# EAGLE design trophy (EAGLE 9.2.2)
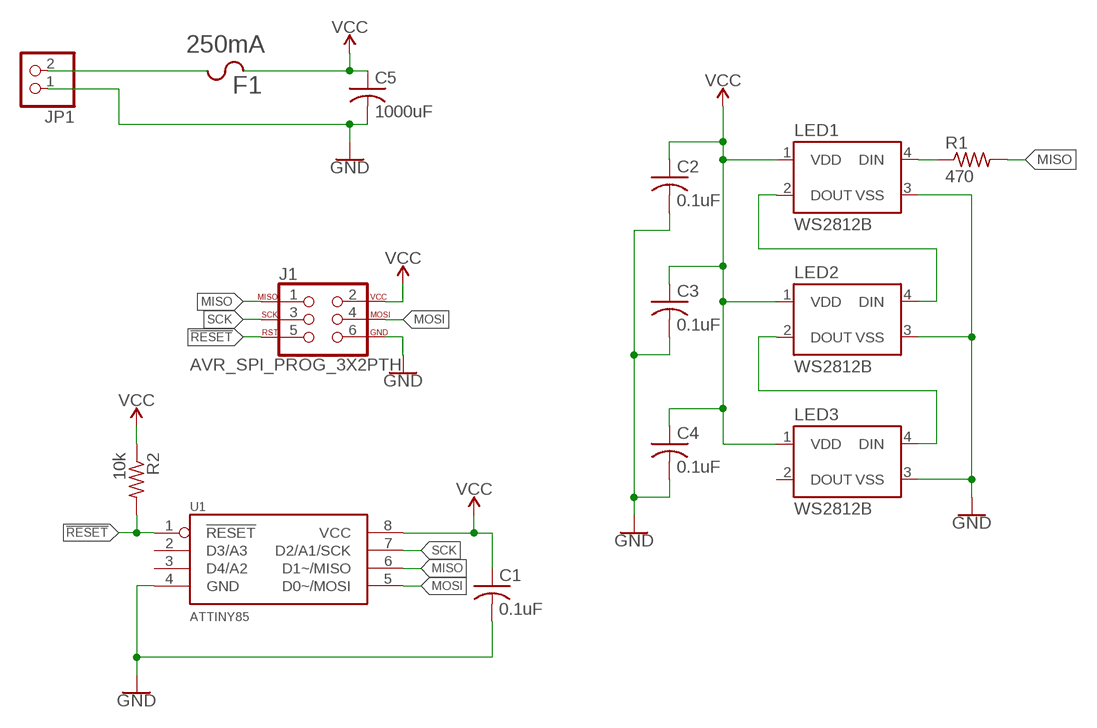
[diagram p0: schematic, sheet 1]

## Parts
C1  0.1uF  C-USC0805  [C0805]
C2  0.1uF  C-USC0805  [C0805]
C3  0.1uF  C-USC0805  [C0805]
C4  0.1uF  C-USC0805  [C0805]
C5  1000uF  CAPACITOR  [CAP-3,5-8]
F1  250mA  FUSE  [F1206]
J1  AVR_SPI_PROG_3X2PTH  [2X3]
JP1  PINHD-1X2  [1X02]
LED1  WS2812B  [5050]
LED2  WS2812B  [5050]
LED3  WS2812B  [5050]
R1  470  R-US_R0805  [R0805]
R2  10k  R-US_R0805  [R0805]
U1  ATTINY85  [8S2]

## Nets
!RESET!: J1.5 R2.2 U1.1(!RESET!)
GND: C1.2 C2.2 C3.2 C4.2 C5.NEGATIVE J1.6 JP1.1 LED1.3(VSS) LED2.3(VSS) LED3.3(VSS) U1.4(GND)
MISO: J1.1 R1.2 U1.6(D1~/MISO)
MOSI: J1.4 U1.5(D0~/MOSI)
N$1: LED1.2(DOUT) LED2.4(DIN)
N$2: LED2.2(DOUT) LED3.4(DIN)
N$3: F1.2 JP1.2
N$6: LED1.4(DIN) R1.1
SCK: J1.3 U1.7(D2/A1/SCK)
VCC: C1.1 C2.1 C3.1 C4.1 C5.POSITIVE F1.1 J1.2 LED1.1(VDD) LED2.1(VDD) LED3.1(VDD) R2.1 U1.8(VCC)
Unconnected: LED3.2(DOUT) U1.2(D3/A3) U1.3(D4/A2)

## Library data of the parts
C1-C4 = resistor:C-US: CAPACITOR, American symbol
C5 = JoshCustom:CAPACITOR
F1 = JoshCustom:FUSE
J1 = SparkFun-Connectors:AVR_SPI_PROG_3X2: AVR ISP 6 Pin This is the reduced ISP connector for AVR programming. Common on Arduino. This footprint will take up less PCB space and can be used with a 10-pin to 6-pin adapter such as SKU: BOB-08508 **Special note about "TEST_POINT" package. The stop mask is on the top side, so if you want your programming test points to be on the bottom of your board, make sure to place this package on the bottom side of the board. This also ensure that the orientation to program from the bottom side will be correct. SparkFun Products: SparkFun ISP Pogo Adapter <https://www.sparkfun.com/products/11591> - NS Tiny AVR Programmer <https://www.sparkfun.com/products/11801> -PTH
JP1 = pinhead:PINHD-1X2: PIN HEADER
LED1-LED3 = RoboJackets-LEDs:WS2812B: WS2812B 5050 RGB LED with Integrated Driver Chip http://www.adafruit.com/products/1655; DIGIKEY: 1528-1104-ND; MPN: 1655
R1 R2 = resistor:R-US_: RESISTOR, American symbol
U1 = JoshCustom:ATTINY85: ATTiny85 microcontroller

## Board
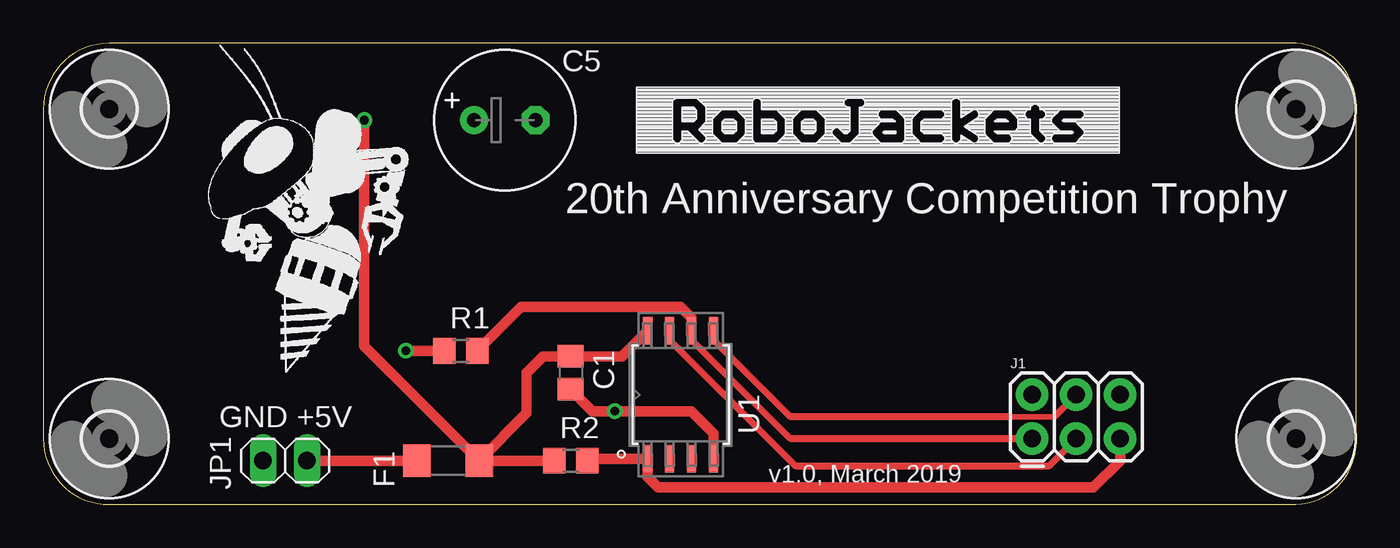
[diagram p1: board, top side]
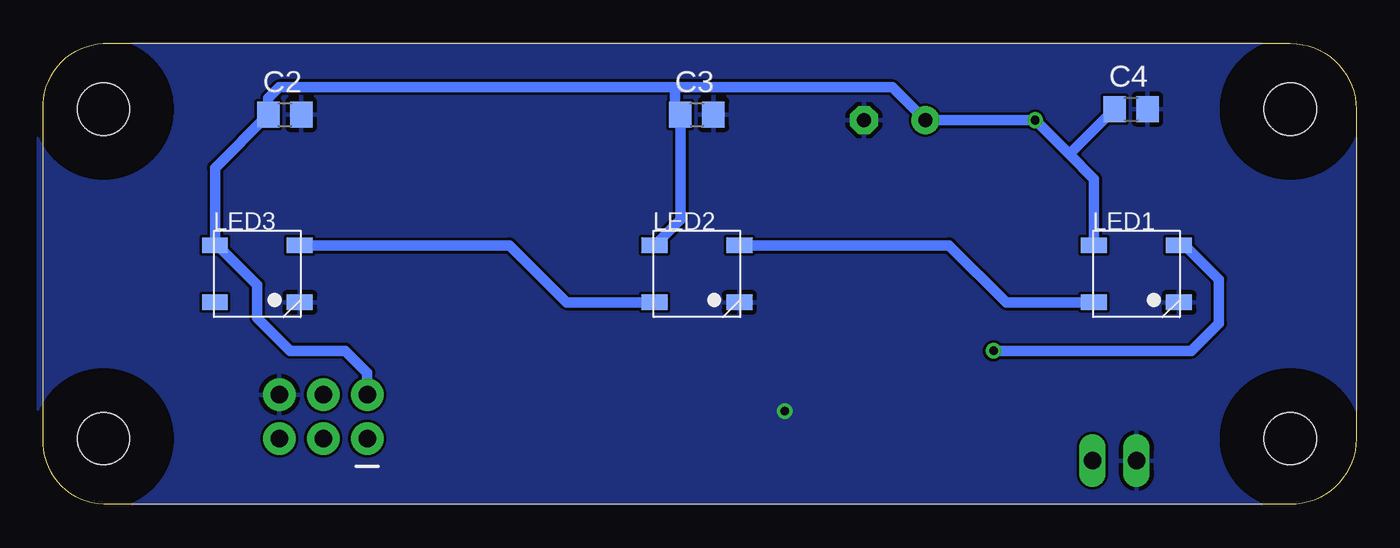
[diagram p2: board, bottom side, seen from below]

Size 75.87 x 26.67 mm. Coordinates in mm from the lower left corner, seen from the top.
Outline: 0,22.85 arc-90 3.8,26.66 3.81,26.67 72.39,26.67 72.4,26.66 arc-90 75.87,22.85 75.87,3.81 arc-90 72.39,0 3.81,0 arc-90 0,3.81 0,22.85
Outline: 0,22.85 0,22.86
Copper layers (1*16): Top 0.0356mm / dielectric 63mil / Bottom 0.0356mm
Design rules "RJ2LayerDRU": minimum track width 6mil, minimum drill 15mil, track to track 6mil, track to pad 6mil, pad to pad 6mil, via to via 6mil, smd to smd 6mil, copper to edge 0mil, drill to drill 6mil, minimum pad ring 10mil, minimum via ring 8mil, stop-mask expansion 4mil, vias tented up to drill 0mil, thermal gap 10mil

### Footprints (pad centres in the part's own frame; a part is rotated, then mirrored left to right if it is on the bottom)
C0805 = smd 1.3 x 1.5: 1 -0.95,0; 2 0.95,0
CAP-3,5-8 = drill 0.813 pad 1.6 octagon: NEGATIVE 1.778,0 | drill 0.813 pad 1.6: POSITIVE -1.778,0
F1206 = smd 1.6 x 1.905: 1 -1.8,0; 2 1.8,0
2X3 = drill 1.016 pad 1.88: 1 0,0; 2 0,2.54; 3 2.54,0; 4 2.54,2.54; 5 5.08,0; 6 5.08,2.54
1X02 = drill 1.016 long: 1 -1.27,0; 2 1.27,0
5050 = smd 1.5 x 0.9: 1 -2.45,1.65; 2 -2.45,-1.65; 3 2.45,-1.65; 4 2.45,1.65
R0805 = smd 1.3 x 1.5: 1 -0.95,0; 2 0.95,0
8S2 = smd 1.575 x 0.533: 1 -3.696,1.905; 2 -3.696,0.635; 3 -3.696,-0.635; 4 -3.696,-1.905; 5 3.696,-1.905; 6 3.696,-0.635; 7 3.696,0.635; 8 3.696,1.905
3,0 = hole 3: 0,0

### Placement (x,y rotation side)
C1  30.48,7.62 270 top
C2  61.91,22.54 0 bottom
C3  38.1,22.54 0 bottom
C4  13.02,22.86 0 bottom
C5  26.67,22.23 0 top
F1  23.39,2.54 180 top
J1  57.15,3.81 0 top
JP1  13.97,2.54 0 top
LED1  12.7,13.34 0 bottom
LED2  38.1,13.34 0 bottom
LED3  63.5,13.34 0 bottom
R1  24.13,8.89 0 top
R2  30.48,2.54 0 top
U1  36.83,6.35 90 top
U$1  [3,0]  3.81,3.81 0 top
U$2  [3,0]  72.39,3.81 0 top
U$3  [3,0]  72.39,22.86 0 top
U$4  [3,0]  3.81,22.86 0 top
U$5  [ROBOBUZZ_1.0X]  13.97,7.62 0 top
U$6  [ROBOJACKETS]  34.29,20.32 0 top

### Tracks (layer width: path | path; a pad name or v marks a point on that pad's centre or on a via)
!RESET!
  Top 0.61: J1.5 62.23,2.54 60.69,1 35.51,1 34.92,1.59 U1.1 31.54,2.65 R2.2
GND  (via drill 0.5)
  Top 0.61: C1.2 31.75,5.4 v33.02,5.4 37.47,5.4 38.73,4.13 U1.4
  pour Bottom: 0,0 76.2,0 76.2,26.67 0,26.67
MISO
  Top 0.406: J1.1 43.18,3.81 37.47,9.53 U1.6
  Top 0.61: R1.2 27.62,11.43 36.83,11.43 37.47,10.79 U1.6
MOSI
  Top 0.305: 55.88,5.08 58.42,5.08
  Top 0.406: 55.88,5.08 43.18,5.08 38.73,9.53 U1.5 | 58.42,5.08 J1.4
N$1
  Bottom 0.61: LED2.4 23.53,14.98 20.23,11.69 LED1.2
N$2
  Bottom 0.61: LED3.4 48.93,14.98 45.63,11.69 LED2.2
N$3
  Top 0.61: JP1.2 F1.2
N$6  (via drill 0.5)
  Top 0.61: R1.1 v20.95,8.89
  Bottom 0.61: LED1.4 9.9,14.98 7.94,13.02 7.94,10.48 9.53,8.89 v20.95,8.89
SCK
  Top 0.406: J1.3 58.1,2.22 43.5,2.22 36.2,9.53 U1.7
VCC  (via drill 0.5)
  Top 0.61: F1.1 R2.1 | F1.1 27.94,5.29 27.94,7.62 28.89,8.57 C1.1 33.45,8.57 U1.8 | F1.1 18.55,9.18 v18.55,22.23
  Bottom 0.61: C4.1 16.58,20.25 | LED1.1 15.15,18.82 16.58,20.25 | 16.58,20.25 v18.55,22.23 C5.POSITIVE 26.8,24.13 39.37,24.13 | 39.37,24.13 62.23,24.13 62.86,23.5 C2.1 65.95,19.45 LED3.1 65.78,14.98 63.5,12.7 63.5,10.79 61.59,8.89 58.42,8.89 57.15,7.62 J1.2 | 39.37,24.13 39.37,22.86 C3.1 39.05,16.48 LED2.1

### Text on the board
tPlace: 20th Anniversary Competition Trophy | GND +5V | v1.0, March 2019